# EAGLE design Mechatronics_Actuator (EAGLE 5.06)
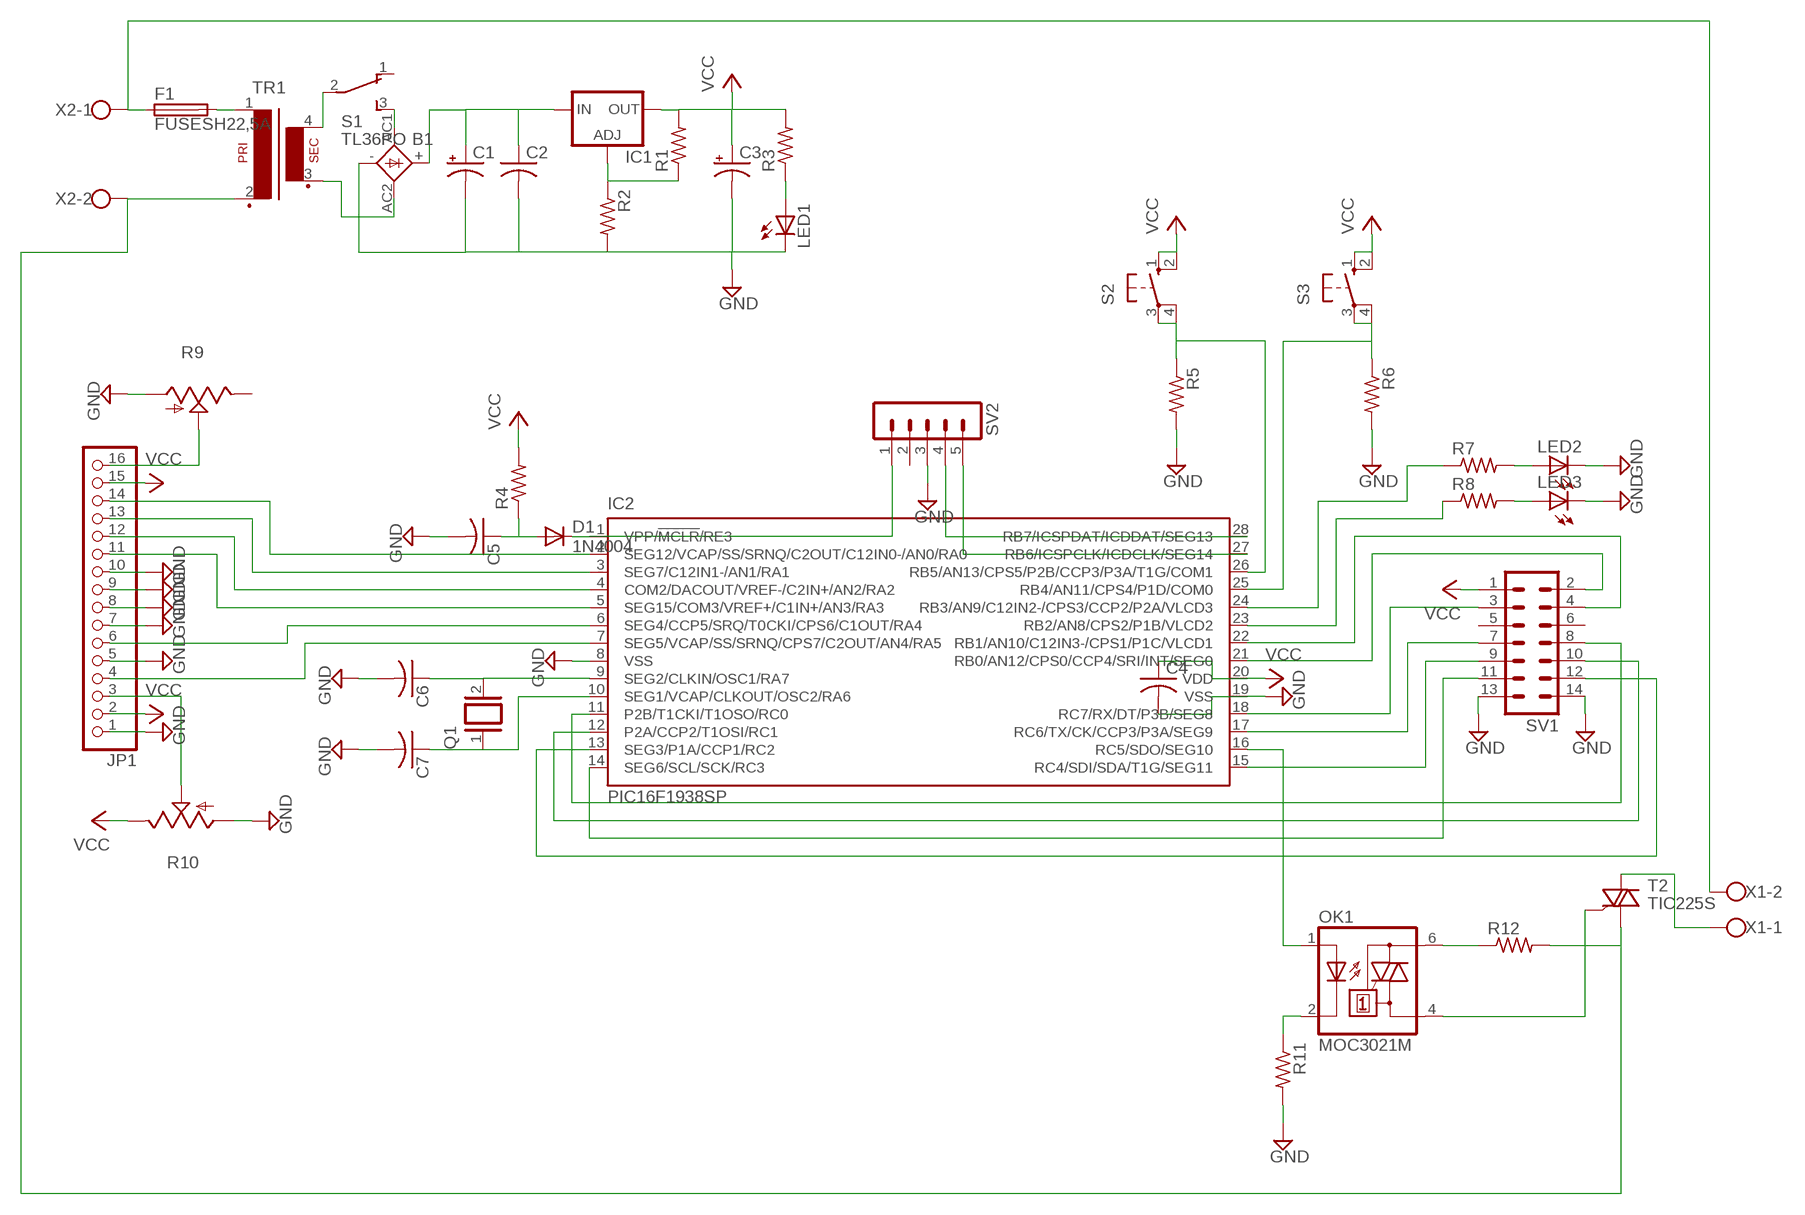
[diagram p0: schematic, sheet 1]

## Parts
B1  1KAB  [1KAB]
C1  CPOL-USE2-5  [E2-5]
C2  C-US025-030X050  [C025-030X050]
C3  CPOL-USE2-4  [E2-4]
C4  C-US025-030X050  [C025-030X050]
C5  C-US025-030X050  [C025-030X050]
C6  C-US025-024X044  [C025-024X044]
C7  C-US025-024X044  [C025-024X044]
D1  1N4004  [DO41-10]
F1  FUSESH22,5A  [SH22,5A]
IC1  LM317TS  [317TS]
IC2  PIC16F1938SP  [DIL28-3]
JP1  PINHD-1X16  [1X16]
LED1  LED5MM  [LED5MM]
LED2  LED5MM  [LED5MM]
LED3  LED5MM  [LED5MM]
OK1  MOC3021M  [DIL06]
Q1  XTAL/S  [QS]
R1  R-US_0207/10  [0207/10]
R2  R-US_0207/10  [0207/10]
R3  R-US_0207/10  [0207/10]
R4  R-US_0207/10  [0207/10]
R5  R-US_0207/10  [0207/10]
R6  R-US_0207/10  [0207/10]
R7  R-US_0207/10  [0207/10]
R8  R-US_0207/10  [0207/10]
R9  TRIM_US-PT-10  [PT-10]
R10  TRIM_US-PT-10  [PT-10]
R11  R-US_0207/10  [0207/10]
R12  R-US_0207/10  [0207/10]
S1  TL36PO  [TL3XPO]
S2  10-XX  [B3F-10XX]
S3  10-XX  [B3F-10XX]
SV1  MA07-2  [MA07-2]
SV2  MA05-1  [MA05-1]
T2  TIC225S  [TO220DS]
TR1  VP31  [VP31]
X1  W237-102  [W237-102]
X2  W237-102  [W237-102]

## Nets
GND: B1.- C1.- C2.2 C3.- C4.2 C5.2 C6.2 C7.2 IC2.8(VSS) IC2.19(VSS) JP1.1 JP1.5 JP1.7 JP1.8 JP1.9 JP1.10 LED1.K(C) LED2.K(C) LED3.K(C) R2.2 R5.2 R6.2 R9.A R10.A R11.2 SV1.13 SV1.14 SV2.3
N$1: F1.1 X1.2 X2.1
N$2: F1.2 TR1.1
N$3: R12.2 T2.A1 TR1.2 X2.2
N$4: S1.2(P) TR1.4(S4)
N$5: B1.AC2 TR1.3(S3)
N$6: B1.+ C1.+ C2.1 IC1.3(IN)
N$7: IC2.25(RB4/AN11/CPS4/P1D/COM0) R6.1 S3.3(P) S3.4(P1)
N$8: B1.AC1 S1.3(S)
N$9: LED1.A R3.1
N$10: IC2.24(RB3/AN9/C12IN2-/CPS3/CCP2/P2A/VLCD3) R7.1
N$11: IC1.1(ADJ) R1.1 R2.1
N$12: IC2.21(RB0/AN12/CPS0/CCP4/SRI/INT/SEG0) SV1.2
N$13: IC2.22(RB1/AN10/C12IN3-/CPS1/P1C/VLCD1) SV1.4
N$14: IC2.18(RC7/RX/DT/P3B/SEG8) SV1.3
N$15: IC2.17(RC6/TX/CK/CCP3/P3A/SEG9) SV1.7
N$16: IC2.11(P2B/T1CKI/T1OSO/RC0) SV1.8
N$17: IC2.15(RC4/SDI/SDA/T1G/SEG11) SV1.9
N$18: IC2.12(P2A/CCP2/T1OSI/RC1) SV1.10
N$19: IC2.14(SEG6/SCL/SCK/RC3) SV1.11
N$20: IC2.13(SEG3/P1A/CCP1/RC2) SV1.12
N$21: C5.1 D1.A R4.1
N$22: D1.C IC2.1(VPP/!MCLR!/RE3) SV2.1
N$23: IC2.23(RB2/AN8/CPS2/P1B/VLCD2) R8.1
N$24: IC2.28(RB7/ICSPDAT/ICDDAT/SEG13) SV2.4
N$25: IC2.27(RB6/ICSPCLK/ICDCLK/SEG14) SV2.5
N$26: C7.1 IC2.10(SEG1/VCAP/CLKOUT/OSC2/RA6) Q1.1
N$27: C6.1 IC2.9(SEG2/CLKIN/OSC1/RA7) Q1.2
N$28: IC2.7(SEG5/VCAP/SS/SRNQ/CPS7/C2OUT/AN4/RA5) JP1.4
N$29: IC2.6(SEG4/CCP5/SRQ/T0CKI/CPS6/C1OUT/RA4) JP1.6
N$30: IC2.5(SEG15/COM3/VREF+/C1IN+/AN3/RA3) JP1.11
N$31: IC2.4(COM2/DACOUT/VREF-/C2IN+/AN2/RA2) JP1.12
N$32: IC2.3(SEG7/C12IN1-/AN1/RA1) JP1.13
N$33: IC2.2(SEG12/VCAP/SS/SRNQ/C2OUT/C12IN0-/AN0/RA0) JP1.14
N$34: LED2.A R7.2
N$35: IC2.26(RB5/AN13/CPS5/P2B/CCP3/P3A/T1G/COM1) R5.1 S2.3(P) S2.4(P1)
N$36: LED3.A R8.2
N$37: JP1.3 R10.S
N$44: JP1.16 R9.S
N$54: IC2.16(RC5/SDO/SEG10) OK1.1(A)
N$55: OK1.2(C) R11.1
N$56: OK1.6(A2) R12.1
N$58: T2.A2 X1.1
N$60: OK1.4(A1) T2.G
VCC: C3.+ C4.1 IC1.2(OUT) IC2.20(VDD) JP1.2 JP1.15 R1.2 R3.2 R4.2 R10.E S2.1(S) S2.2(S1) S3.1(S) S3.2(S1) SV1.1
Unconnected: R9.E S1.1(O) SV1.5 SV1.6 SV2.2

## Library data of the parts
B1 = rectifier:1KAB: RECTIFIER grid 5,08 x 5,08 mm
C1 C3 = rcl:CPOL-US: POLARIZED CAPACITOR, American symbol
C2 C4-C7 = rcl:C-US: CAPACITOR, American symbol
D1 = diode:1N4004: DIODE general purpose rectifier, 1 A
F1 = fuse:FUSE: Fuse
IC1 = v-reg:LM317TS: VOLTAGE REGULATOR
IC2 = microchip-update-2:PIC16F19*: Flash-Based, 8-Bit CMOS Microcontrollers wtih LCD Driver and nanoWatt XLP Technology Auto generated by make-symbol-device-package-bsdl.ulp Rev. 33 Source: http://ww1.microchip.com/downloads/en/DeviceDoc/41364D.pdf
JP1 = nrf905:PINHD-1X16: PIN HEADER
LED1-LED3 = led:LED: LED OSRAM: - CHIPLED LG R971, LG N971, LY N971, LG Q971, LY Q971, LO R971, LY R971 LH N974, LH R974 LS Q976, LO Q976, LY Q976 LO Q996 - Hyper CHIPLED LW Q18S LB Q993, LB Q99A, LB R99A - SideLED LS A670, LO A670, LY A670, LG A670, LP A670 LB A673, LV A673, LT A673, LW A673 LH A674 LY A675 LS A676, LA A676, LO A676, LY A676, LW A676 LS A679, LY A679, LG A679 - Hyper Micro SIDELED® LS Y876, LA Y876, LO Y876, LY Y876 LT Y87S - SmartLED LW L88C, LW L88S LB L89C, LB L89S, LG L890 LS L89K, LO L89K, LY L89K LS L896, LA L896, LO L896, LY L896 - TOPLED LS T670, LO T670, LY T670, LG T670, LP T670 LSG T670, LSP T670, LSY T670, LOP T670, LYG T670 LG T671, LOG T671, LSG T671 LB T673, LV T673, LT T673, LW T673 LH T674 LS T676, LA T676, LO T676, LY T676, LB T676, LH T676, LSB T676, LW T676 LB T67C, LV T67C, LT T67C, LS T67K, LO T67K, LY T67K, LW E67C LS E67B, LA E67B, LO E67B, LY E67B, LB E67C, LV E67C, LT E67C LW T67C LS T679, LY T679, LG T679 LS T770, LO T770, LY T770, LG T770, LP T770 LB T773, LV T773, LT T773, LW T773 LH T774 LS E675, LA E675, LY E675, LS T675 LS T776, LA T776, LO T776, LY T776, LB T776 LHGB T686 LT T68C, LB T68C - Hyper Mini TOPLED® LB M676 - Mini TOPLED Santana® LG M470 LS M47K, LO M47K, LY M47K Source: http://www.osram.convergy.de LUXEON: - LUMILED® LXK2-PW12-R00, LXK2-PW12-S00, LXK2-PW14-U00, LXK2-PW14-V00 LXK2-PM12-R00, LXK2-PM12-S00, LXK2-PM14-U00 LXK2-PE12-Q00, LXK2-PE12-R00, LXK2-PE12-S00, LXK2-PE14-T00, LXK2-PE14-U00 LXK2-PB12-K00, LXK2-PB12-L00, LXK2-PB12-M00, LXK2-PB14-N00, LXK2-PB14-P00, LXK2-PB14-Q00 LXK2-PR12-L00, LXK2-PR12-M00, LXK2-PR14-Q00, LXK2-PR14-R00 LXK2-PD12-Q00, LXK2-PD12-R00, LXK2-PD12-S00 LXK2-PH12-R00, LXK2-PH12-S00 LXK2-PL12-P00, LXK2-PL12-Q00, LXK2-PL12-R00 Source: www.luxeon.com KINGBRIGHT: KA-3528ASYC Source: www.kingbright.com
OK1 = optocoupler:MOC30*M: RANDOM-PHASE OPTOISOLATORS TRIAC DRIVER OUTPUT Source: http://www.fairchildsemi.com MOC3020-M.pdf
Q1 = special:XTAL/S: CRYSTAL
R1-R8 R11 R12 = resistor:R-US_: RESISTOR, American symbol
R9 R10 = pot:TRIM_US-: POTENTIOMETER
S1 = switch:TL36PO: TINY SWITCH ON - ON Source: http://www2.produktinfo.conrad.com/datenblaetter/700000-724999/705152-da-01-de-Subminiaturschalter_TL_36YO.pdf
S2 S3 = switch-omron:10-XX: OMRON SWITCH
SV1 = con-lstb:MA07-2: PIN HEADER
SV2 = con-lstb:MA05-1: PIN HEADER
T2 = triac:TIC225S: TRIAC
TR1 = trafo:VP31: TRANSFORMER 1 primary winding, 1 secondary winding BLOCK
X1 X2 = con-wago-500:W237-102: WAGO SCREW CLAMP

## Board
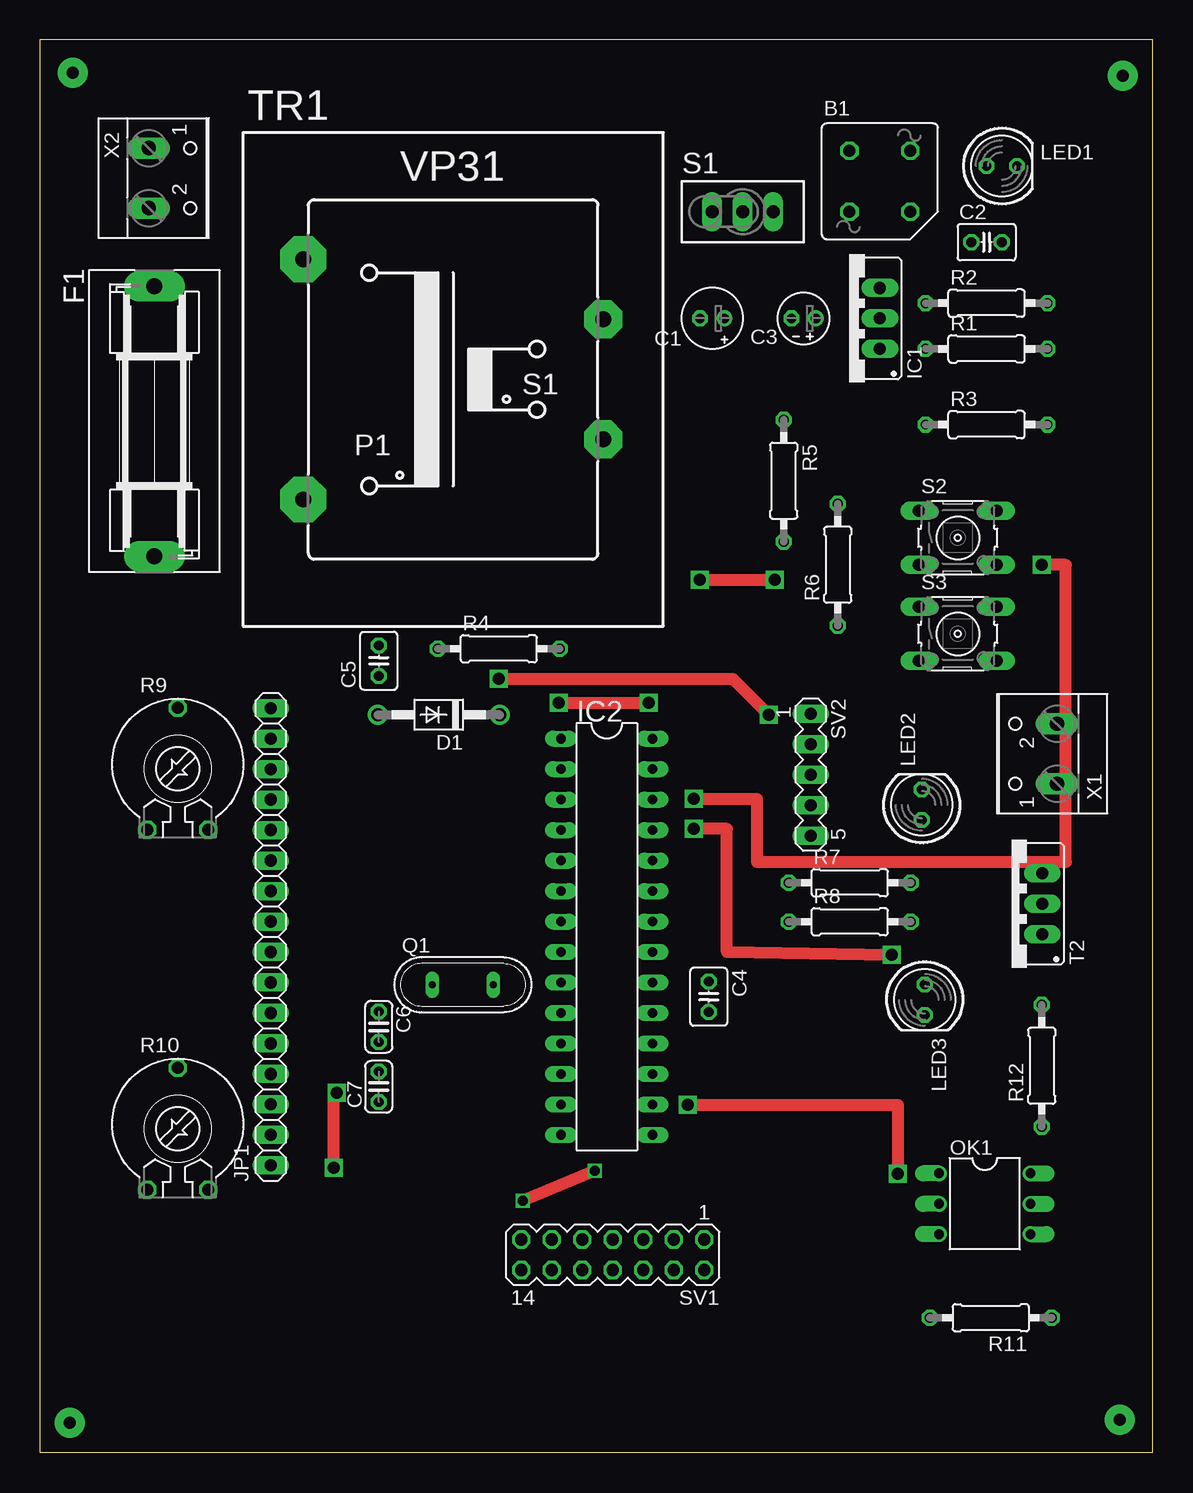
[diagram p1: board, top side]
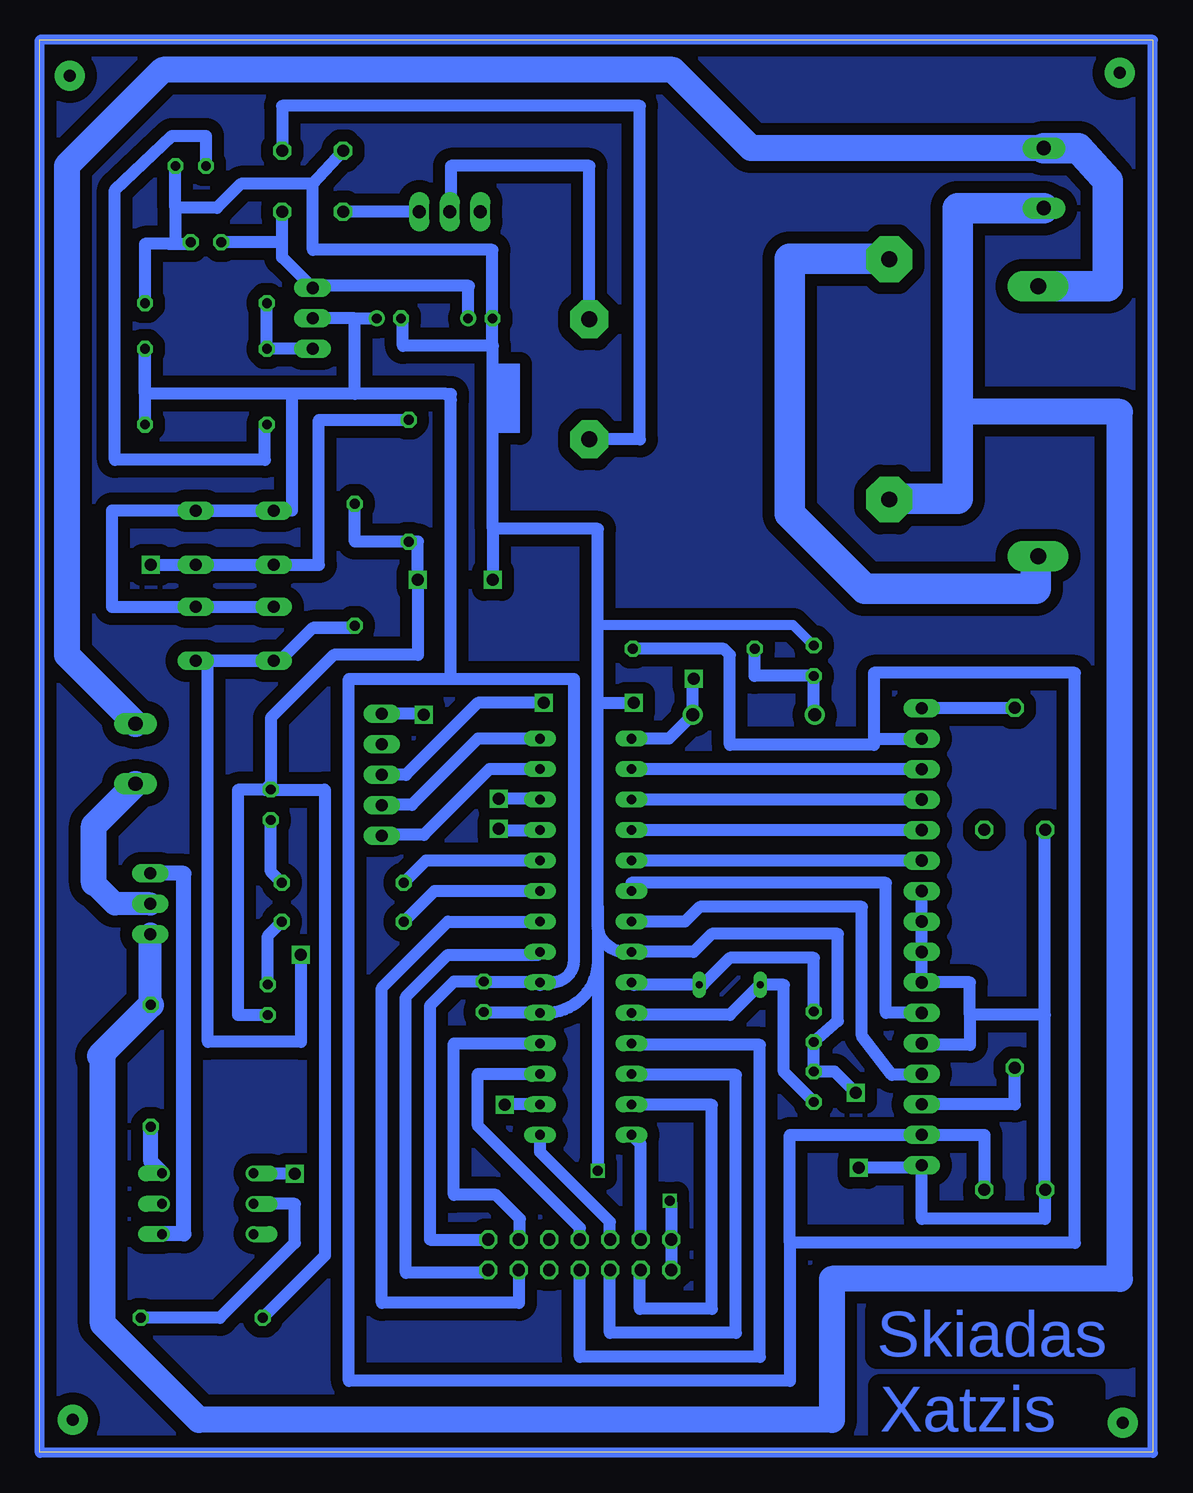
[diagram p2: board, bottom side, seen from below]

Size 92.75 x 117.69 mm. Coordinates in mm from the lower left corner, seen from the top.
Outline: 0,0 92.75,0 92.75,117.69 0,117.69 0,0
Copper layers (1*16): Top 0.035mm / dielectric 1.5mm / Bottom 0.035mm
Design rules "default *": minimum track width 10mil, minimum drill 24mil, track to track 1mm, track to pad 1mm, pad to pad 1mm, via to via 1mm, smd to smd 8mil, copper to edge 1mm, drill to drill 1mm, minimum pad ring 10mil, minimum via ring 8mil, stop-mask expansion 4mil, vias tented up to drill 0mil, thermal gap 10mil

### Footprints (pad centres in the part's own frame; a part is rotated, then mirrored left to right if it is on the bottom)
1KAB = drill 1.016 octagon: + 2.54,-2.54; - -2.54,2.54; AC1 -2.54,-2.54; AC2 2.54,2.54
E2-5 = drill 0.813 pad 1.27 round: + -1.016,0 | drill 0.813 pad 1.27 octagon: - 1.016,0
C025-030X050 = drill 0.813 octagon: 1 -1.27,0; 2 1.27,0
E2-4 = drill 0.813 pad 1.27 round: + -1.016,0 | drill 0.813 pad 1.27 octagon: - 1.016,0
C025-024X044 = drill 0.813 octagon: 1 -1.27,0; 2 1.27,0
DO41-10 = drill 1.118 round: A 5.08,0; C -5.08,0
SH22,5A = drill 1.321 pad 2.54 long: 1 -11.252,0; 2 11.252,0
317TS = drill 1.016 long: 1 -2.54,-2.54; 2 0,-2.54; 3 2.54,-2.54
DIL28-3 = drill 0.813 long: 1 -16.51,-3.81; 2 -13.97,-3.81; 3 -11.43,-3.81; 4 -8.89,-3.81; 5 -6.35,-3.81; 6 -3.81,-3.81; 7 -1.27,-3.81; 8 1.27,-3.81; 9 3.81,-3.81; 10 6.35,-3.81; 11 8.89,-3.81; 12 11.43,-3.81; 13 13.97,-3.81; 14 16.51,-3.81; 15 16.51,3.81; 16 13.97,3.81; 17 11.43,3.81; 18 8.89,3.81; 19 6.35,3.81; 20 3.81,3.81; 21 1.27,3.81; 22 -1.27,3.81; 23 -3.81,3.81; 24 -6.35,3.81; 25 -8.89,3.81; 26 -11.43,3.81; 27 -13.97,3.81; 28 -16.51,3.81
1X16 = drill 1.016 long: 1 -19.05,0; 2 -16.51,0; 3 -13.97,0; 4 -11.43,0; 5 -8.89,0; 6 -6.35,0; 7 -3.81,0; 8 -1.27,0; 9 1.27,0; 10 3.81,0; 11 6.35,0; 12 8.89,0; 13 11.43,0; 14 13.97,0; 15 16.51,0; 16 19.05,0
LED5MM = drill 0.813 octagon: A -1.27,0; K 1.27,0
DIL06 = drill 0.813 offset: 1 -2.54,-3.81; 2 0,-3.81; 3 2.54,-3.81; 4 2.54,3.81; 5 0,3.81; 6 -2.54,3.81
QS = drill 0.61 long: 1 -2.54,0; 2 2.54,0
0207/10 = drill 0.813 octagon: 1 -5.08,0; 2 5.08,0
PT-10 = drill 1.016 octagon: A -2.54,-5.08; E 2.54,-5.08; S 0,5.08
TL3XPO = drill 1.1 pad 1.422 long: 1 -2.54,0; 2 0,0; 3 2.54,0
B3F-10XX = drill 1.016 long: 1 -3.251,2.261; 2 3.251,2.261; 3 -3.251,-2.261; 4 3.251,-2.261
MA07-2 = drill 1.016 octagon: 1 -7.62,-1.27; 2 -7.62,1.27; 3 -5.08,-1.27; 4 -5.08,1.27; 5 -2.54,-1.27; 6 -2.54,1.27; 7 0,-1.27; 8 0,1.27; 9 2.54,-1.27; 10 2.54,1.27; 11 5.08,-1.27; 12 5.08,1.27; 13 7.62,-1.27; 14 7.62,1.27
MA05-1 = drill 1.016 long: 1 -5.08,0; 2 -2.54,0; 3 0,0; 4 2.54,0; 5 5.08,0
TO220DS = drill 1.016 long: A1 -2.54,-2.54; A2 0,-2.54; G 2.54,-2.54
VP31 = drill 1.321 pad 3.81 octagon: 1 -12.497,10.008; 2 -12.497,-10.008 | drill 1.321 pad 3.175 octagon: 3 12.497,-5.004; 4 12.497,5.004
W237-102 = drill 1.194 long: 1 -2.5,-1.27; 2 2.5,-1.27

### Placement (x,y rotation side)
B1  70.01,105.9 0 top
C1  56.04,94.47 180 top
C2  78.9,100.82 0 top
C3  63.66,94.47 180 top
C4  55.75,37.94 270 top
C5  28.25,65.94 90 top
C6  28.25,35.44 270 top
C7  28.25,30.44 90 top
D1  33.25,61.44 180 top
F1  9.55,85.89 270 top
IC1  67.47,94.47 90 top
IC2  47.25,42.94 270 top
JP1  19.25,42.94 90 top
LED1  80.17,107.17 0 top
LED2  73.5,53.94 90 top
LED3  73.75,37.69 270 top
OK1  78.75,20.69 270 top
Q1  35.25,38.94 0 top
R1  78.9,91.93 0 top
R2  78.9,95.74 0 top
R3  78.9,85.62 0 top
R4  38.25,66.94 0 top
R5  62,80.94 270 top
R6  66.5,73.94 90 top
R7  67.5,47.44 0 top
R8  67.5,44.19 0 top
R9  11.5,56.94 0 top
R10  11.5,26.94 0 top
R11  79.25,11.19 180 top
R12  83.5,32.19 90 top
S1  58.58,103.36 0 top
S2  76.5,76.19 0 top
S3  76.5,68.19 0 top
SV1  47.75,16.44 180 top
SV2  64.25,56.44 270 top
T2  81,45.69 90 top
TR1  34.45,89.39 0 top
X1  83.5,58.19 90 top
X2  10.35,106.16 270 top

### Tracks (layer width: path | path; a pad name or v marks a point on that pad's centre or on a via)
GND  (via drill 0.8, 1)
  Top 1.016: v46.25,23.44 v40.25,20.94 | v43.25,62.44 v50.75,62.44 | v24.75,29.94 24.5,29.69 v24.5,23.69 | v55,72.69 v61.25,72.69
  Bottom 0.813: C5.2 29.98,68.94 46.25,68.94
  Bottom 1.016: 70,105.69 B1.- | C3.- 62.5,94.33 62.5,92.19 55,92.19 | 55,92.19 55.02,92.21 C1.- 55.02,100.19 70,100.19 70,105.69 | C2.2 80.17,100.69 82,100.69 | 82,100.69 84,100.69 84,95.74 R2.2 | 81.44,103.69 81.44,100.69 82,100.69 | 81.44,103.69 LED1.K | 70,105.69 76,105.69 78,103.69 81.44,103.69 | SV1.14 SV1.13 40.13,20.82 v40.25,20.94 | 46.25,45.44 46.25,43.94 arc-90 43.98,41.67 IC2.8 38.27,41.67 36.75,43.19 26.25,43.19 26.25,35.92 C6.2 C7.2 26.52,31.71 v24.75,29.94 | 46.25,45.44 46.25,62.44 | 46.25,62.44 46.25,68.94 46.25,76.94 55,76.94 | 46.25,45.44 46.25,42.94 | 46.25,42.94 46.25,40.94 arc90 50.6,36.59 IC2.19 55.67,36.59 C4.2 | 46.25,42.94 v46.25,23.44 | JP1.10 JP1.9 JP1.8 JP1.7 15.25,39.13 15.25,36.44 | 15.25,36.44 15.25,33.94 19.25,33.94 JP1.5 | 9,36.44 9,21.86 R10.A 8.96,19.44 19.25,19.44 JP1.1 19.25,23.69 v24.5,23.69 | 9,36.44 15.25,36.44 | R9.A 9,51.86 9,36.44 | SV2.3 62.25,56.44 56.25,62.44 v50.75,62.44 | 46.25,62.44 v43.25,62.44 | 55,76.94 55,92.19 | LED3.K 76.25,36.42 76.25,55.19 74,55.19 | 74,55.19 73.5,55.19 LED2.K | R6.2 66.5,75.86 R5.2 61.25,75.86 v61.25,72.69 61.25,66.44 68.25,66.44 73.5,61.19 73.5,55.69 74,55.19 | LED2.K 73.25,55.21 | 55,76.94 v55,72.69 | R11.2 69,16.36 69,55.19 69.02,55.21 LED2.K
N$1
  Bottom 2.184: X2.1 33.47,108.66 40,115.19 82.5,115.19 90.5,107.19 90.5,66.42 X1.2
  Bottom 2.54: X2.1 6.22,108.66 3.75,105.94 3.75,97.14 F1.1
N$2
  Bottom 2.54: F1.2 9.75,74.64 9.75,71.94 24,71.94 30.25,78.19 30.25,99.44 21.95,99.44 TR1.1
N$3
  Bottom 1.93: 83.54,37.27 T2.A1
  Bottom 2.184: 83.54,37.27 R12.2 87.75,33.02 87.5,33.02 87.5,10.69 79.5,2.69 26.75,2.69 26.75,14.44 2.75,14.44 2.75,86.69 16.25,86.69 16.25,86.44
  Bottom 2.54: X2.2 16.25,103.66 16.25,86.44 16.25,79.44 21.95,79.44 TR1.2
N$4
  Bottom 1.016: TR1.4 46.95,107.19 58.5,107.19 58.5,103.36 S1.2
N$5
  Bottom 1.016: B1.AC2 72.55,112.19 42.75,112.19 42.75,84.39 TR1.3
N$6
  Bottom 1.016: C1.+ 57.06,97.13 57,97.19 69.83,97.19 IC1.3 72.55,99.55 72.55,100.82 | 72.55,100.82 B1.+ | 72.55,100.82 C2.1
N$7  (via drill 1)
  Top 1.016: v54.5,51.94 57.25,51.94 57.25,41.69 v71,41.44
  Bottom 1.016: 66.5,68.93 R6.1 66.67,68.69 | IC2.25 54.5,51.83 v54.5,51.94 | 72.75,65.93 S3.3 S3.4 77.75,65.94 | 72.75,65.93 72.26,65.93 | v71,41.44 71,34.19 78.75,34.19 78.75,65.94 72.75,65.94 70,68.69 66.67,68.69 | 66.67,68.69 69.99,68.69 72.75,65.93
N$8
  Bottom 1.016: S1.3 B1.AC1
N$9
  Bottom 1.016: LED1.A 78.9,109.69 81.75,109.69 86.5,105.19 86.5,82.69 74,82.69 74,85.62 R3.1
N$10
  Bottom 1.016: R7.1 60.57,49.29 IC2.24
N$11
  Bottom 1.016: IC1.1 R1.1 R2.1
N$12
  Bottom 1.016: SV1.2 55.37,14.94 62.25,14.94 62.25,37.94 58.75,41.44 51.29,41.44 IC2.21
N$13
  Bottom 1.016: SV1.4 52.83,12.44 64.25,12.44 64.25,38.69 58.73,44.21 IC2.22
N$14
  Bottom 1.016: IC2.18 58.25,34.05 58.25,21.44 54.75,21.44 52.75,19.44 52.75,17.79 SV1.3
N$15
  Bottom 1.016: IC2.17 56.25,31.51 56.25,27.19 47.75,18.69 SV1.7
N$16
  Bottom 1.016: SV1.8 47.75,7.94 32.75,7.94 32.75,33.94 43.44,33.94 IC2.11
N$17
  Bottom 1.016: IC2.15 51.06,25 45.25,19.19 45.25,17.75 SV1.9
N$18
  Bottom 1.016: SV1.10 45.25,15.17 45.25,9.94 34.75,9.94 34.75,31.44 43.44,31.44 IC2.12
N$19
  Bottom 1.016: SV1.11 42.67,25.66 IC2.14
N$20
  Bottom 1.016: SV1.12 42.75,15.17 42.75,11.94 36.75,11.94 36.75,28.94 43.44,28.94 IC2.13
N$21
  Bottom 1.016: R4.1 33.17,64.67 C5.1 28.25,61.52 D1.A
N$22  (via drill 1)
  Top 1.016: v60.75,61.44 57.75,64.44 v38.25,64.44
  Bottom 1.016: IC2.1 40.32,59.45 D1.C 38.33,64.36 v38.25,64.44 | SV2.1 60.83,61.52 v60.75,61.44
N$23
  Bottom 1.016: R8.1 59.86,46.75 IC2.23
N$24
  Bottom 1.016: IC2.28 56.24,59.45 61.75,53.94 63.21,53.94 SV2.4
N$25
  Bottom 1.016: IC2.27 55.28,56.91 60.75,51.44 63.17,51.44 SV2.5
N$26
  Bottom 1.016: IC2.10 43.29,36.44 35.25,36.44 32.75,38.94 Q1.1 30.75,38.94 30.75,31.67 C7.1
N$27
  Bottom 1.016: C6.1 28.25,41.19 35.25,41.19 37.5,38.94 Q1.2 43.25,38.94 IC2.9
N$28
  Bottom 1.016: IC2.7 38.98,44.21 37.75,45.44 24.25,45.44 24.25,34.69 21.75,31.44 19.32,31.44 JP1.4 19.25,31.44
N$29
  Bottom 1.016: JP1.6 22.25,36.59 22.25,47.44 43.44,47.44 IC2.6
N$30
  Bottom 1.016: JP1.11 IC2.5
N$31
  Bottom 1.016: JP1.12 IC2.4
N$32
  Bottom 1.016: JP1.13 IC2.3
N$33
  Bottom 1.016: JP1.14 IC2.2
N$34
  Bottom 1.016: 73.58,52.59 LED2.A 73.5,48.36 R7.2
N$35  (via drill 1)
  Top 1.016: v83.5,73.94 85.5,73.94 85.5,49.19 59.75,49.19 59.75,54.44 v54.5,54.44
  Bottom 1.016: R5.1 69.5,86.02 69.5,73.94 S2.3 S2.4 83.5,73.93 v83.5,73.94 | v54.5,54.44 51.06,54.44 IC2.26
N$36
  Bottom 1.016: LED3.A 73.75,43.02 R8.2
N$37
  Bottom 1.016: JP1.3 11.5,28.97 R10.S
N$38  (via drill 0.8)
  other vias: 40.25,20.94
N$39  (via drill 1)
  other vias: 54,28.94
N$40  (via drill 1)
  other vias: 60.75,61.44
N$41  (via drill 1)
  other vias: 38.25,64.44
N$42  (via drill 1)
  other vias: 43.25,62.44
N$43  (via drill 1)
  other vias: 24.75,29.94
N$44
  Bottom 1.016: JP1.16 11.5,61.99 R9.S
N$45  (via drill 1)
  other vias: 24.75,29.94
N$46  (via drill 1)
  other vias: 24.5,23.69
N$47  (via drill 1)
  other vias: 54.5,54.44
N$48  (via drill 1)
  other vias: 54.5,51.94
N$49  (via drill 1)
  other vias: 83.5,73.94
N$50  (via drill 1)
  other vias: 71,41.44
N$51  (via drill 1)
  other vias: 61.25,72.69
N$52  (via drill 1)
  other vias: 55,72.69
N$53  (via drill 1)
  other vias: 71.5,23.19
N$54  (via drill 1)
  Top 1.016: v54,28.94 71.5,28.94 v71.5,23.19
  Bottom 1.016: IC2.16 54,28.97 v54,28.94 | v71.5,23.19 74.94,23.19 OK1.1
N$55
  Bottom 1.016: R11.1 77.75,11.19 71.5,17.44 71.5,20.69 OK1.2
N$56
  Bottom 1.27: R12.1 83.5,24.17 OK1.6
N$57  (via drill 1 pad 2.54)
  other vias: 90.25,114.69
N$58
  Bottom 1.93: 88.25,47.44 86.5,45.69 T2.A2
  Bottom 2.184: X1.1 88.25,52.21 88.25,47.44
N$59  (via drill 1 pad 2.54)
  other vias: 2.75,114.94
N$60
  Bottom 1.27: T2.G 80.75,48.23 80.75,18.19 82.56,18.19 OK1.4
N$61  (via drill 1 pad 2.54)
  other vias: 2.5,2.44
N$62  (via drill 1 pad 2.54)
  other vias: 90,2.69
N$63
  Bottom 0.813: 0,117.69 92.75,117.69 92.75,-0.06 0,-0.06 0,117.69
N$64
  pour Bottom: 0,117.69 92.75,117.69 92.75,-0.06 0,-0.06
VCC
  Bottom 1.016: 66.5,94.47 C3.+ | 66.5,94.47 IC1.2 | R3.2 R1.2 83.98,88.19 71.75,88.19 | 66.5,88.19 71.75,88.19 | 66.5,88.19 66.5,94.47 | 59,88.19 58.5,88.19 | 59,88.19 66.5,88.19 | IC2.20 50.06,39.13 arc-90 48.25,40.94 48.25,64.44 58.5,64.44 | 59,88.19 arc90 58.5,87.69 58.5,64.44 | SV1.1 60.25,17.71 60.25,37.19 58.23,39.21 C4.1 55.67,39.13 IC2.20 | IC2.20 51.06,38.94 | R10.E 14.04,26.43 JP1.2 30.25,26.43 30.25,17.44 | 30.25,17.44 30.25,5.94 67,5.94 67,64.44 58.5,64.44 | JP1.15 23.25,59.45 23.25,59.94 | 23.25,59.94 23.25,64.94 6.5,64.94 6.5,17.44 30.25,17.44 | R4.2 35.75,66.94 35.25,66.44 35.25,58.94 23.25,58.94 23.25,59.94 | S3.1 S3.2 86.75,70.44 86.75,78.45 S2.2 | S2.2 S2.1 | S2.2 71.75,78.45 71.75,88.19
(copper drawn outside any net)
  shapes: Bottom area x1

### Text on the board
Bottom: Skiadas | Xatzis